# EAGLE design Camera Gantry (EAGLE 6.4)
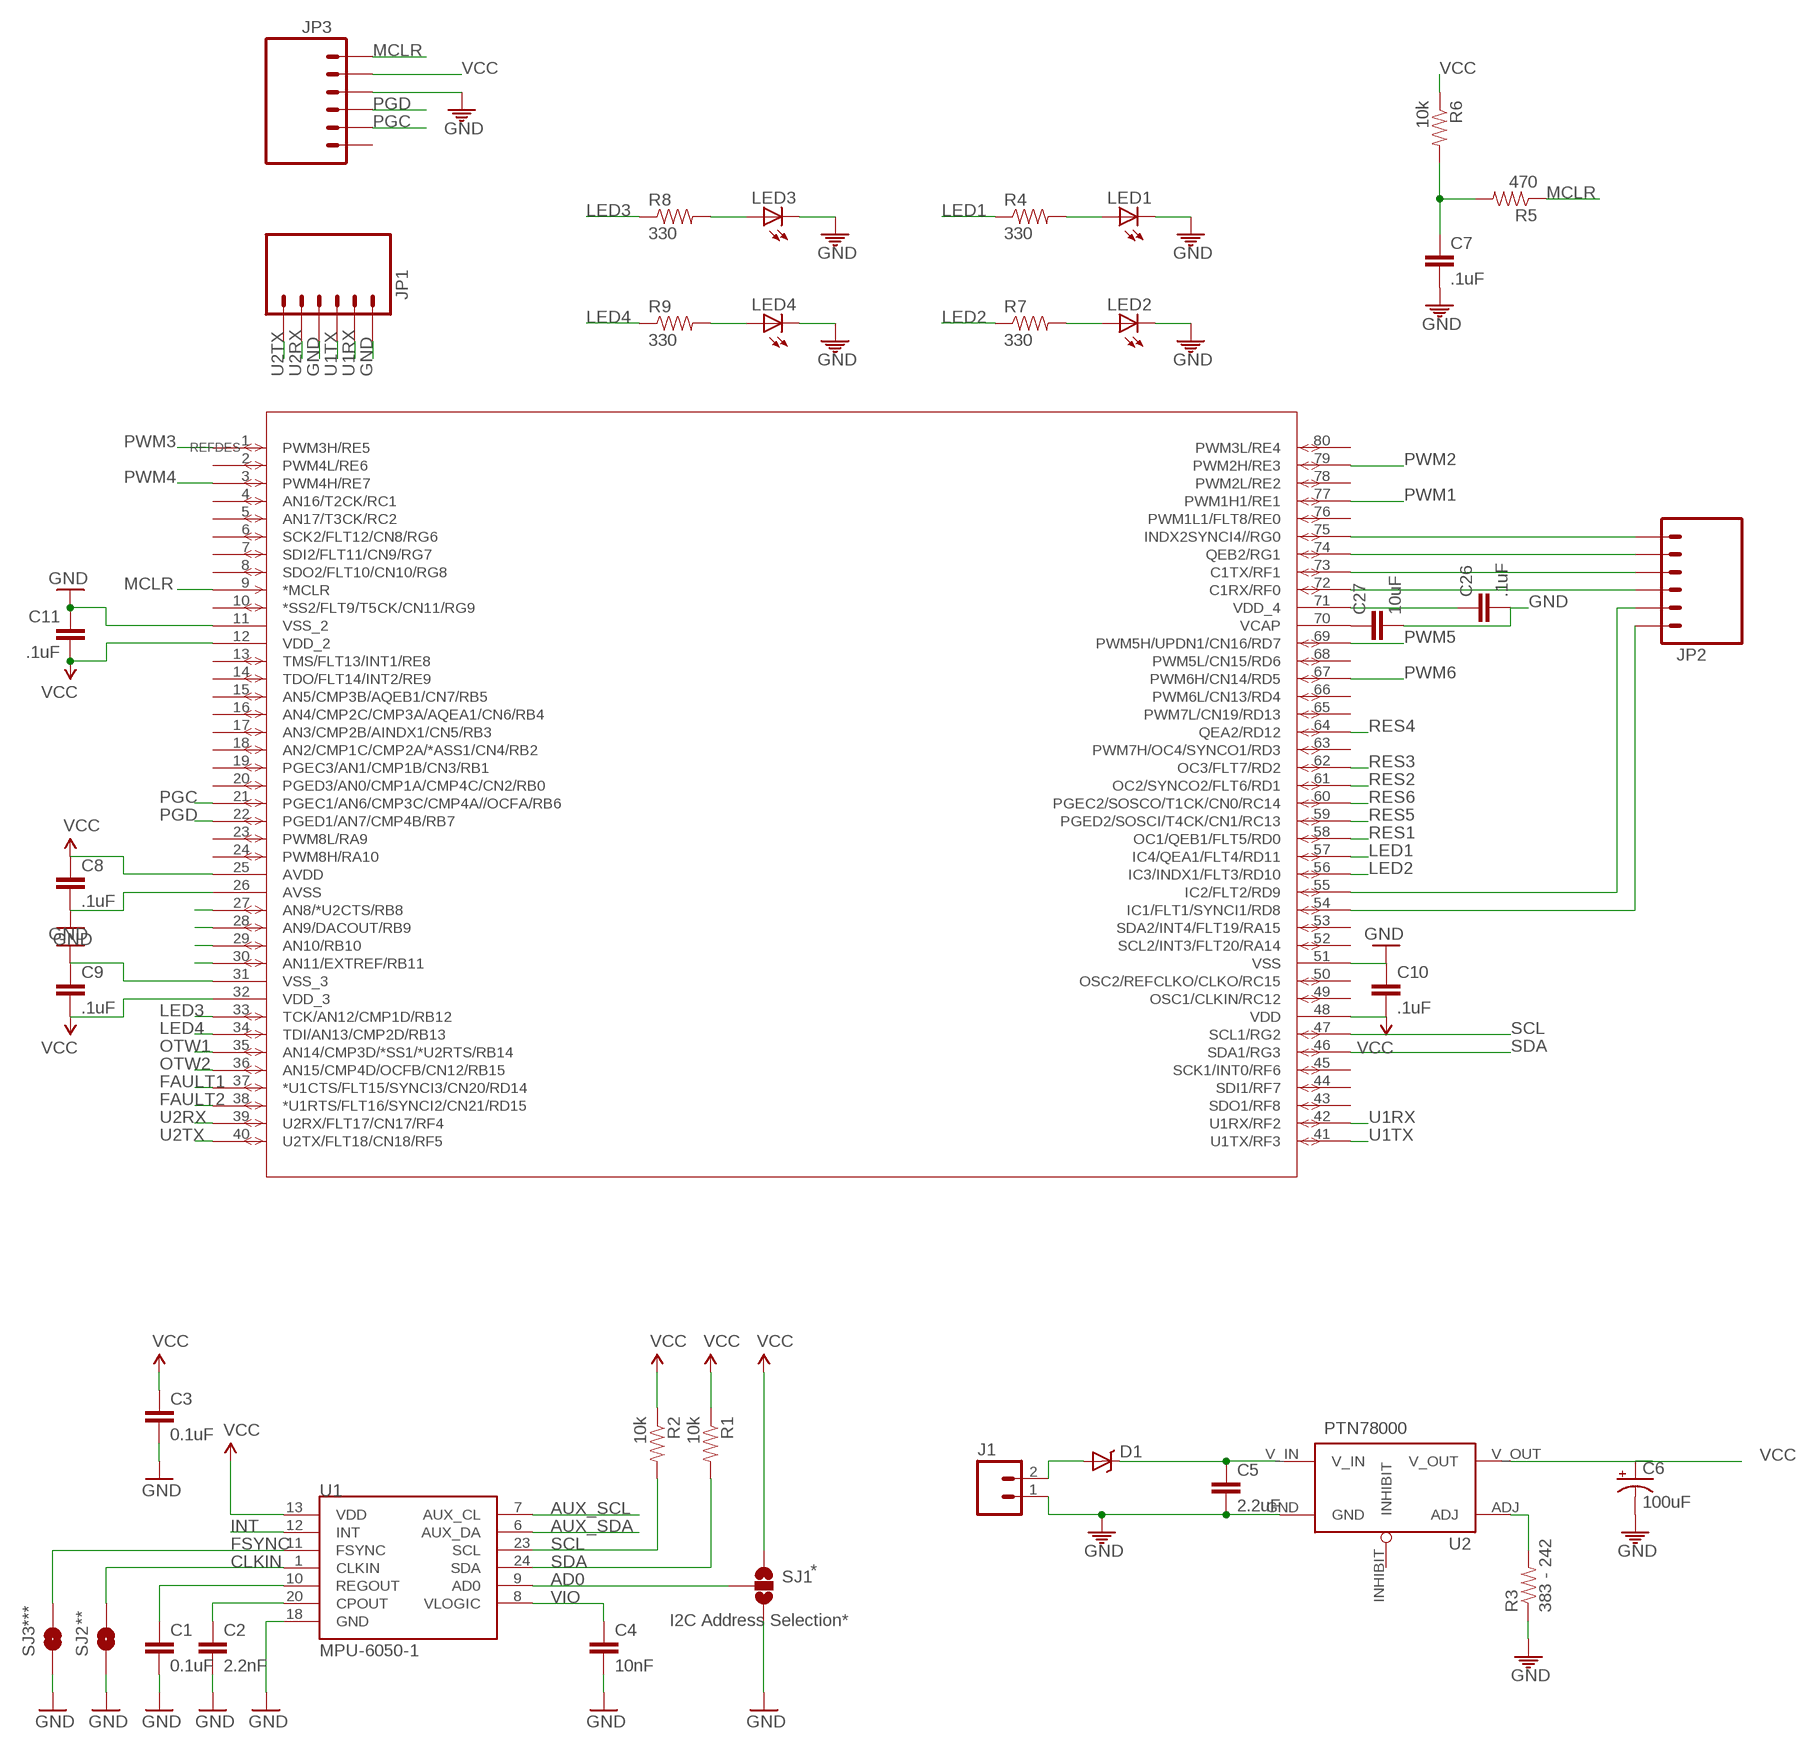
[diagram p0: schematic, sheet 1, part 1 of 2]
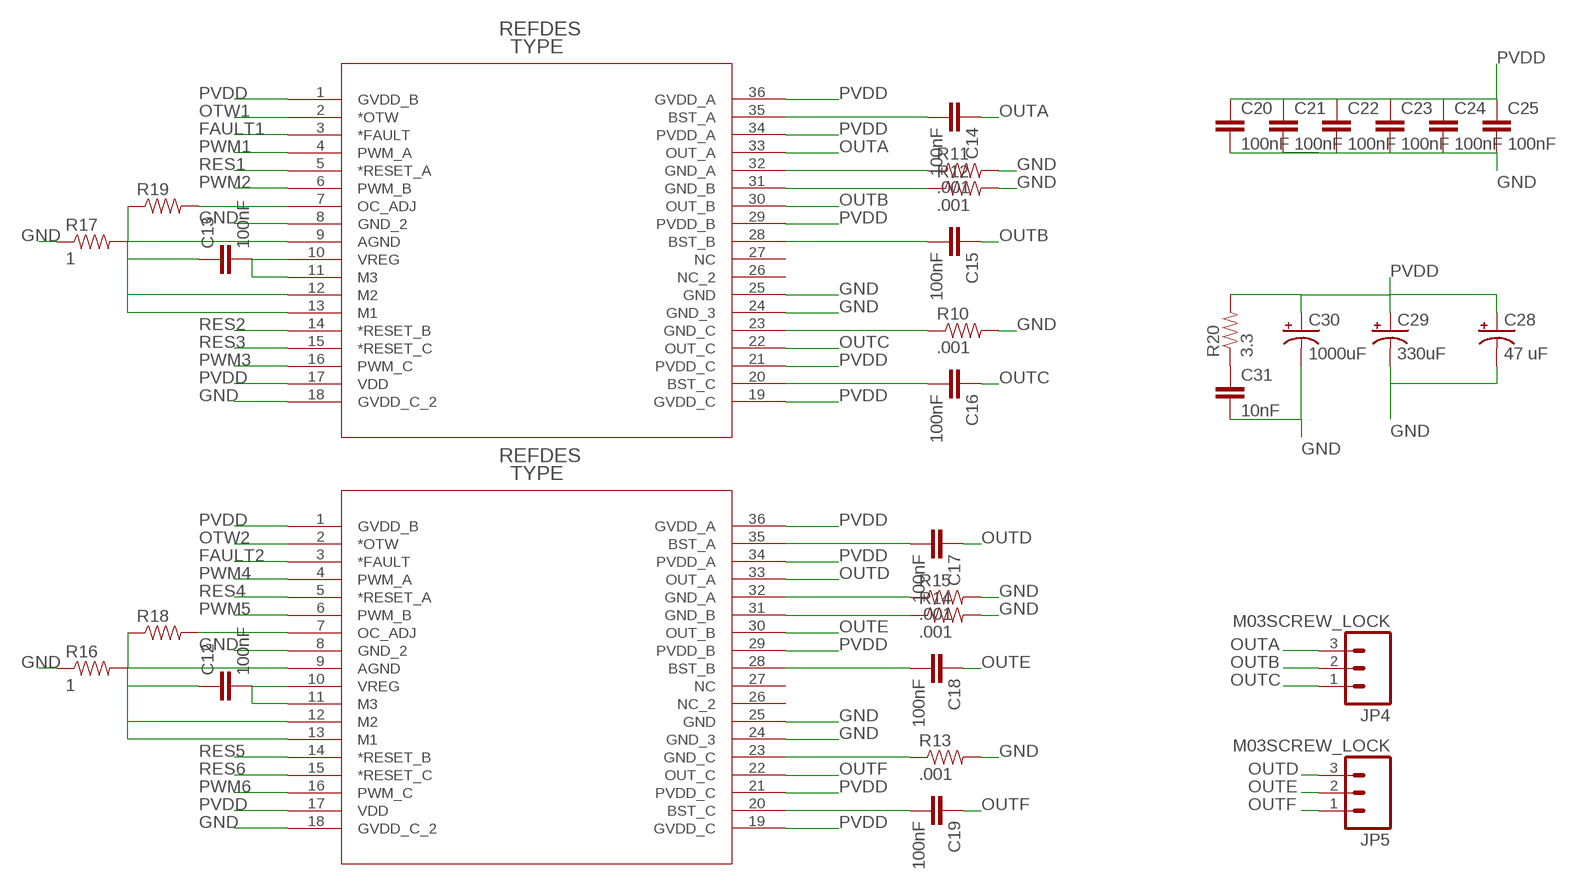
[diagram p1: schematic, sheet 1, part 2 of 2]

## Parts
C1  0.1uF  CAP1206  [1206]
C2  2.2nF  CAP1206  [1206]
C3  0.1uF  CAP1206  [1206]
C4  10nF  CAP1206  [1206]
C5  2.2uF  CAP1206  [1206]
C6  100uF  CAP_POLPTH1  [CPOL-RADIAL-100UF-25V]
C7  .1uF  CAP1206  [1206]
C8  .1uF  CAP1206  [1206]
C9  .1uF  CAP1206  [1206]
C10  .1uF  CAP1206  [1206]
C11  .1uF  CAP1206  [1206]
C12  100nF  CAP1206  [1206]
C13  100nF  CAP1206  [1206]
C14  100nF  CAP1206  [1206]
C15  100nF  CAP1206  [1206]
C16  100nF  CAP1206  [1206]
C17  100nF  CAP1206  [1206]
C18  100nF  CAP1206  [1206]
C19  100nF  CAP1206  [1206]
C20  100nF  CAP1206  [1206]
C21  100nF  CAP1206  [1206]
C22  100nF  CAP1206  [1206]
C23  100nF  CAP1206  [1206]
C24  100nF  CAP1206  [1206]
C25  100nF  CAP1206  [1206]
C26  .1uF  CAP1206  [1206]
C27  10uF  CAP1206  [1206]
C28  47 uF  CAP_POLPTH2  [CPOL-RADIAL-10UF-25V]
C29  330uF  CAP_POLPTH1  [CPOL-RADIAL-100UF-25V]
C30  1000uF  CAP_POLPTH4  [CPOL-RADIAL-1000UF-25V]
C31  10nF  CAP1206  [1206]
D1  DIODE-SCHOTTKY240A  [SMA-DIODE-B240A]
J1  M025MM  [SCREWTERMINAL-5MM-2]
JP1  M06SIP  [1X06]
JP2  M06SIP  [1X06]
JP3  M06LOCK  [1X06_LOCK]
JP4  M03SCREW_LOCK  [SCREWTERMINAL-3.5MM-3_LOCK.007S]
JP5  M03SCREW_LOCK  [SCREWTERMINAL-3.5MM-3_LOCK.007S]
LED1  LED1206  [LED-1206]
LED2  LED1206  [LED-1206]
LED3  LED1206  [LED-1206]
LED4  LED1206  [LED-1206]
R1  10k  RESISTOR0805-RES  [0805]
R2  10k  RESISTOR0805-RES  [0805]
R3  383 - 242  RESISTOR0805-RES  [0805]
R4  330  RESISTOR0805-RES  [0805]
R5  470  RESISTOR0805-RES  [0805]
R6  10k  RESISTOR0805-RES  [0805]
R7  330  RESISTOR0805-RES  [0805]
R8  330  RESISTOR0805-RES  [0805]
R9  330  RESISTOR0805-RES  [0805]
R10  .001  RESISTOR2512  [R2512]
R11  .001  RESISTOR2512  [R2512]
R12  .001  RESISTOR2512  [R2512]
R13  .001  RESISTOR2512  [R2512]
R14  .001  RESISTOR2512  [R2512]
R15  .001  RESISTOR2512  [R2512]
R16  1  RESISTOR0805-RES  [0805]
R17  1  RESISTOR0805-RES  [0805]
R18  RESISTOR0805-RES  [0805]
R19  RESISTOR0805-RES  [0805]
R20  3.3  RESISTOR0805-RES  [0805]
SJ1  SOLDERJUMPER_2WAYPASTE2&3  [SJ_3_PASTE2&3]
SJ2  SOLDERJUMPERTRACE  [SJ_2S-TRACE]
SJ3  SOLDERJUMPERTRACE  [SJ_2S-TRACE]
U1  MPU-6050-1  [QFN-24-4MM2]
U2  PTN78000  PTN78000THROUGH-HOLE  [PTN78000]
U3  DRV8332_DKD_36  [DKD36]
U4  DRV8332_DKD_36  [DKD36]
U$1  DSPIC33FJ64GS608  [TQFP80_12X12MC]

## Nets
AD0: SJ1.2 U1.9(AD0)
AUX_SCL: U1.7(AUX_CL)
AUX_SDA: U1.6(AUX_DA)
CLKIN: SJ2.2 U1.1(CLKIN)
FAULT1: U3.3(*FAULT) U$1.37(*U1CTS/FLT15/SYNCI3/CN20/RD14)
FAULT2: U4.3(*FAULT) U$1.38(*U1RTS/FLT16/SYNCI2/CN21/RD15)
FSYNC: SJ3.2 U1.11(FSYNC)
GND: C1.2 C2.2 C3.2 C4.2 C5.2 C6.2(-) C7.2 C8.2 C9.1 C10.1 C11.1 C20.2 C21.2 C22.2 C23.2 C24.2 C25.2 C26.2 C27.2 C28.2(-) C29.2(-) C30.2(-) C31.2 J1.1 JP1.1 JP1.4 JP3.3 LED1.C LED2.C LED3.C LED4.C R3.1 R10.2 R11.2 R12.2 R13.2 R14.2 R15.2 R16.1 R17.1 SJ1.3 SJ2.1 SJ3.1 U1.18(GND) U2.GND U3.8(GND_2) U3.18(GVDD_C_2) U3.24(GND_3) U3.25(GND) U4.8(GND_2) U4.18(GVDD_C_2) U4.24(GND_3) U4.25(GND) U$1.11(VSS_2) U$1.26(AVSS) U$1.31(VSS_3) U$1.51(VSS)
INT: U1.12(INT)
LED1: R4.1 U$1.57(IC4/QEA1/FLT4/RD11)
LED2: R7.1 U$1.56(IC3/INDX1/FLT3/RD10)
LED3: R8.1 U$1.33(TCK/AN12/CMP1D/RB12)
LED4: R9.1 U$1.34(TDI/AN13/CMP2D/RB13)
MCLR: JP3.1 R5.1 U$1.9(*MCLR)
N$1: LED1.A R4.2
N$2: C7.1 R5.2 R6.2
N$3: C2.1 U1.20(CPOUT)
N$4: LED2.A R7.2
N$5: C1.1 U1.10(REGOUT)
N$6 [power]: R3.2 U2.ADJ
N$7: D1.A J1.2
N$8: LED3.A R8.2
N$9: LED4.A R9.2
N$10: U$1.27(AN8/*U2CTS/RB8)
N$11: U$1.28(AN9/DACOUT/RB9)
N$12: U$1.29(AN10/RB10)
N$13: U$1.30(AN11/EXTREF/RB11)
N$14: R11.1 U3.32(GND_A)
N$15: R12.1 U3.31(GND_B)
N$16: R10.1 U3.23(GND_C)
N$17: C13.1 R17.2 R19.1 U3.9(AGND) U3.12(M2) U3.13(M1)
N$18: C12.1 R16.2 R18.1 U4.9(AGND) U4.12(M2) U4.13(M1)
N$19: R18.2 U4.7(OC_ADJ)
N$20: C12.2 U4.10(VREG) U4.11(M3)
N$21: C13.2 U3.10(VREG) U3.11(M3)
N$22: R15.1 U4.32(GND_A)
N$23: R14.1 U4.31(GND_B)
N$24: R13.1 U4.23(GND_C)
N$25: C17.2 U4.35(BST_A)
N$26: C18.2 U4.28(BST_B)
N$27: C19.2 U4.20(BST_C)
N$28: C14.2 U3.35(BST_A)
N$29: C15.2 U3.28(BST_B)
N$30: C16.2 U3.20(BST_C)
N$31: JP2.3 U$1.72(C1RX/RF0)
N$32: JP2.4 U$1.73(C1TX/RF1)
N$33: JP2.5 U$1.74(QEB2/RG1)
N$34: R19.2 U3.7(OC_ADJ)
N$35: JP2.6 U$1.75(INDX2SYNCI4//RG0)
N$36: JP2.1 U$1.54(IC1/FLT1/SYNCI1/RD8)
N$37: JP2.2 U$1.55(IC2/FLT2/RD9)
N$38: C26.1 U$1.71(VDD_4)
N$39: C27.1 U$1.70(VCAP)
N$41: C31.1 R20.1
OTW1: U3.2(*OTW) U$1.35(AN14/CMP3D/*SS1/*U2RTS/RB14)
OTW2: U4.2(*OTW) U$1.36(AN15/CMP4D/OCFB/CN12/RB15)
OUTA: C14.1 JP4.3 U3.33(OUT_A)
OUTB: C15.1 JP4.2 U3.30(OUT_B)
OUTC: C16.1 JP4.1 U3.22(OUT_C)
OUTD: C17.1 JP5.3 U4.33(OUT_A)
OUTE: C18.1 JP5.2 U4.30(OUT_B)
OUTF: C19.1 JP5.1 U4.22(OUT_C)
PGC: JP3.5 U$1.21(PGEC1/AN6/CMP3C/CMP4A//OCFA/RB6)
PGD [small]: JP3.4 U$1.22(PGED1/AN7/CMP4B/RB7)
PVDD [power]: C5.1 C20.1 C21.1 C22.1 C23.1 C24.1 C25.1 C28.1(+) C29.1(+) C30.1(+) D1.C R20.2 U2.V_IN U3.1(GVDD_B) U3.17(VDD) U3.19(GVDD_C) U3.21(PVDD_C) U3.29(PVDD_B) U3.34(PVDD_A) U3.36(GVDD_A) U4.1(GVDD_B) U4.17(VDD) U4.19(GVDD_C) U4.21(PVDD_C) U4.29(PVDD_B) U4.34(PVDD_A) U4.36(GVDD_A)
PWM1: U3.4(PWM_A) U$1.77(PWM1H1/RE1)
PWM2: U3.6(PWM_B) U$1.79(PWM2H/RE3)
PWM3: U3.16(PWM_C) U$1.1(PWM3H/RE5)
PWM4: U4.4(PWM_A) U$1.3(PWM4H/RE7)
PWM5: U4.6(PWM_B) U$1.69(PWM5H/UPDN1/CN16/RD7)
PWM6: U4.16(PWM_C) U$1.67(PWM6H/CN14/RD5)
RES1: U3.5(*RESET_A) U$1.58(OC1/QEB1/FLT5/RD0)
RES2: U3.14(*RESET_B) U$1.61(OC2/SYNCO2/FLT6/RD1)
RES3: U3.15(*RESET_C) U$1.62(OC3/FLT7/RD2)
RES4: U4.5(*RESET_A) U$1.64(QEA2/RD12)
RES5: U4.14(*RESET_B) U$1.59(PGED2/SOSCI/T4CK/CN1/RC13)
RES6: U4.15(*RESET_C) U$1.60(PGEC2/SOSCO/T1CK/CN0/RC14)
SCL: R2.2 U1.23(SCL) U$1.47(SCL1/RG2)
SDA: R1.2 U1.24(SDA) U$1.46(SDA1/RG3)
U1RX: JP1.2 U$1.42(U1RX/RF2)
U1TX: JP1.3 U$1.41(U1TX/RF3)
U2RX: JP1.5 U$1.39(U2RX/FLT17/CN17/RF4)
U2TX: JP1.6 U$1.40(U2TX/FLT18/CN18/RF5)
VCC: C3.1 C6.1(+) C8.1 C9.2 C10.2 C11.2 JP3.2 R1.1 R2.1 R6.1 SJ1.1 U1.13(VDD) U2.V_OUT U$1.12(VDD_2) U$1.25(AVDD) U$1.32(VDD_3) U$1.48(VDD)
VIO: C4.1 U1.8(VLOGIC)
Unconnected: JP3.6 U2.INHIBIT U3.26(NC_2) U3.27(NC) U4.26(NC_2) U4.27(NC) U$1.2(PWM4L/RE6) U$1.4(AN16/T2CK/RC1) U$1.5(AN17/T3CK/RC2) U$1.6(SCK2/FLT12/CN8/RG6) U$1.7(SDI2/FLT11/CN9/RG7) U$1.8(SDO2/FLT10/CN10/RG8) U$1.10(*SS2/FLT9/T5CK/CN11/RG9) U$1.13(TMS/FLT13/INT1/RE8) U$1.14(TDO/FLT14/INT2/RE9) U$1.15(AN5/CMP3B/AQEB1/CN7/RB5) U$1.16(AN4/CMP2C/CMP3A/AQEA1/CN6/RB4) U$1.17(AN3/CMP2B/AINDX1/CN5/RB3) U$1.18(AN2/CMP1C/CMP2A/*ASS1/CN4/RB2) U$1.19(PGEC3/AN1/CMP1B/CN3/RB1) U$1.20(PGED3/AN0/CMP1A/CMP4C/CN2/RB0) U$1.23(PWM8L/RA9) U$1.24(PWM8H/RA10) U$1.43(SDO1/RF8) U$1.44(SDI1/RF7) U$1.45(SCK1/INT0/RF6) U$1.49(OSC1/CLKIN/RC12) U$1.50(OSC2/REFCLKO/CLKO/RC15) U$1.52(SCL2/INT3/FLT20/RA14) U$1.53(SDA2/INT4/FLT19/RA15) U$1.63(PWM7H/OC4/SYNCO1/RD3) U$1.65(PWM7L/CN19/RD13) U$1.66(PWM6L/CN13/RD4) U$1.68(PWM5L/CN15/RD6) U$1.76(PWM1L1/FLT8/RE0) U$1.78(PWM2L/RE2) U$1.80(PWM3L/RE4)

## Notes on the sheet
- *
- *** | ** | I2C Address Selection*

## Library data of the parts
C1-C4 C8-C27 C31 = ASL:CAP: Capacitor Standard 0603 ceramic capacitor, and 0.1" leaded capacitor.
C5 C7 = CMPE118lib:CAP: Capacitor Standard 0603 ceramic capacitor, and 0.1" leaded capacitor.
C6 C28-C30 = ASL:CAP_POL: Capacitor Polarized These are standard SMD and PTH capacitors. Normally 10uF, 47uF, and 100uF in electrolytic and tantalum varieties. Always verify the external diameter of the through hole cap, it varies with capacity, voltage, and manufacturer. The EIA devices should be standard.
D1 = CMPE118lib:DIODE-SCHOTTKY
J1 = ASL:M02: Header 2 Standard 2-pin 0.1" header. Use with straight break away headers (SKU : PRT-00116), right angle break away headers (PRT-00553), swiss pins (PRT-00743), machine pins (PRT-00117), and female headers (PRT-00115). Molex polarized connector foot print use with SKU : PRT-08233 with associated crimp pins and housings.
JP1 JP2 = ASL:M06: Header 6 Standard 6-pin 0.1" header. Use with straight break away headers (SKU : PRT-00116), right angle break away headers (PRT-00553), swiss pins (PRT-00743), machine pins (PRT-00117), and female headers (PRT-00115). Molex polarized connector foot print use with SKU : PRT-08094 with associated crimp pins and housings. NOTES ON THE VARIANTS LOCK and LOCK_LONGPADS... This footprint was designed to help hold the alignment of a through-hole component (i.e. 6-pin header) while soldering it into place. You may notice that each hole has been shifted either up or down by 0.005 of an inch from it's more standard position (which is a perfectly straight line). This slight alteration caused the pins (the squares in the middle) to touch the edges of the holes. Because they are alternating, it causes a "brace" to hold the component in place. 0.005 has proven to be the perfect amount of "off-center" position when using our standard breakaway headers. Although looks a little odd when you look at the bare footprint, once you have a header in there, the alteration is very hard to notice. Also, if you push a header all the way into place, it is covered up entirely on the bottom side. This idea of altering the position of holes to aid alignment will be further integrated into the Sparkfun Library for other footprints. It can help hold any component with 3 or more connection pins.
JP3 = CMPE118lib:M06: Header 6 Standard 6-pin 0.1" header. Use with straight break away headers (SKU : PRT-00116), right angle break away headers (PRT-00553), swiss pins (PRT-00743), machine pins (PRT-00117), and female headers (PRT-00115). Molex polarized connector foot print use with SKU : PRT-08094 with associated crimp pins and housings. NOTES ON THE VARIANTS LOCK and LOCK_LONGPADS... This footprint was designed to help hold the alignment of a through-hole component (i.e. 6-pin header) while soldering it into place. You may notice that each hole has been shifted either up or down by 0.005 of an inch from it's more standard position (which is a perfectly straight line). This slight alteration caused the pins (the squares in the middle) to touch the edges of the holes. Because they are alternating, it causes a "brace" to hold the component in place. 0.005 has proven to be the perfect amount of "off-center" position when using our standard breakaway headers. Although looks a little odd when you look at the bare footprint, once you have a header in there, the alteration is very hard to notice. Also, if you push a header all the way into place, it is covered up entirely on the bottom side. This idea of altering the position of holes to aid alignment will be further integrated into the Sparkfun Library for other footprints. It can help hold any component with 3 or more connection pins.
JP4 JP5 = ASL:M03: Header 3 Standard 3-pin 0.1" header. Use with straight break away headers (SKU : PRT-00116), right angle break away headers (PRT-00553), swiss pins (PRT-00743), machine pins (PRT-00117), and female headers (PRT-00115). Molex polarized connector foot print use with SKU : PRT-08232 with associated crimp pins and housings.
LED1-LED4 = CMPE118lib:LED: LEDs Standard schematic elements and footprints for 5mm, 3mm, 1206, and 0603 sized LEDs. 5mm - Spark Fun Electronics SKU : COM-00529 (and others); COLOR: red
R1-R9 = CMPE118lib:RESISTOR: Resistor Basic schematic elements and footprints for 0603, 1206, and PTH resistors.
R10-R20 = ASL:RESISTOR: Resistor Basic schematic elements and footprints for 0603, 1206, and PTH resistors.
SJ1 = SparkFun:SOLDERJUMPER_2WAY: Solder Jumper 2 way solder jumper
SJ2 SJ3 = SparkFun:SOLDERJUMPER: Solder Jumper Standard SMD solder jumper. Used to automate production. Two varients : Normally Open and Normally Closed are the same, but have different paste layers. NC will have a large amount of paste and should jumper during reflow.
U1 = Testing:MPU-6050
U2 = ASL:PTN78000: This is the PTN78000 part by Texas Instruments. It's a 1.5A adjustable switching regulator.
U3 U4 = CameraGantry:DRV8332_DKD_36
U$1 = CameraGantry:DSPIC33FJ64GS608

## Net classes
0 default: width 0.406 mm
1 power: width 0.762 mm, clearance 0.254 mm to class 0, clearance 0.508 mm
2 small: width 0.254 mm, clearance 0.254 mm to class 1

## Board
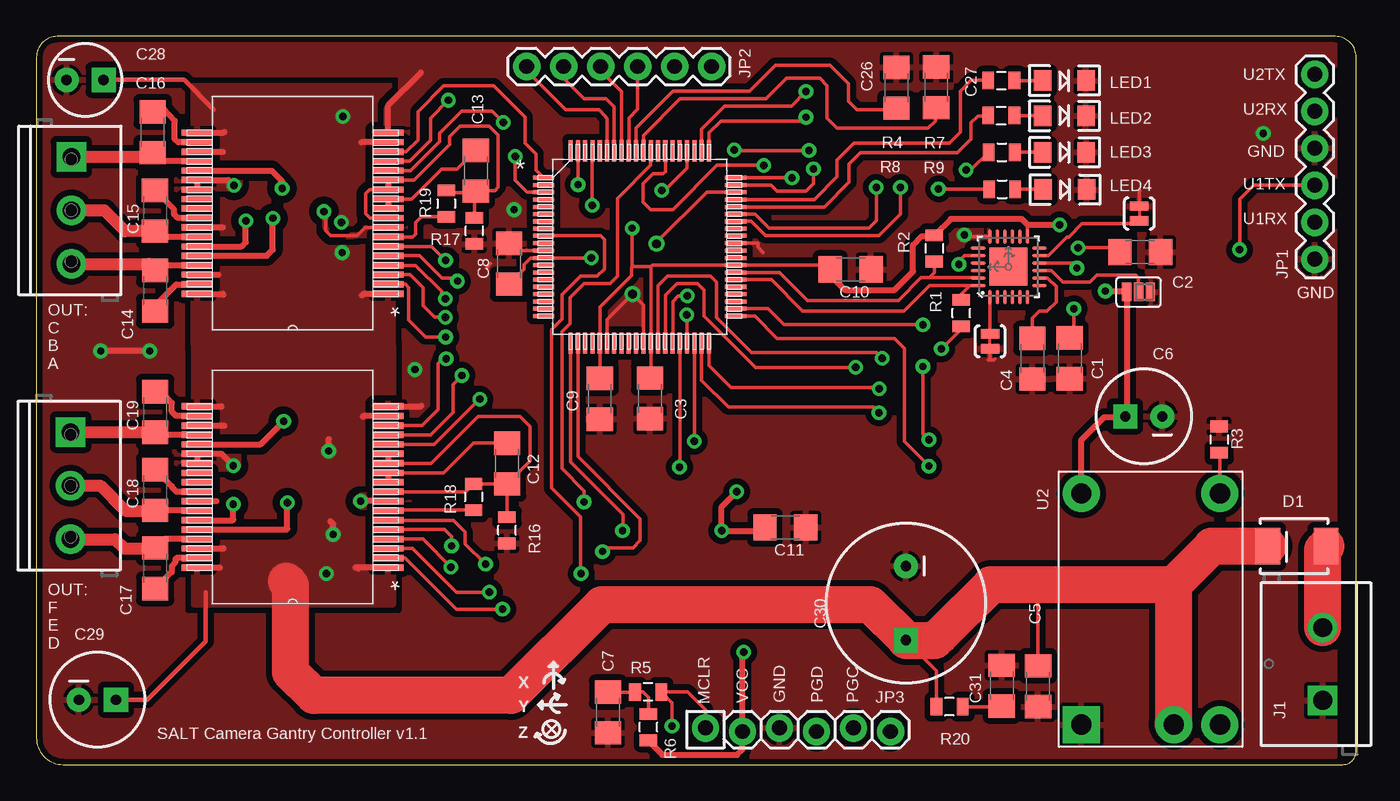
[diagram p2: board, top side]
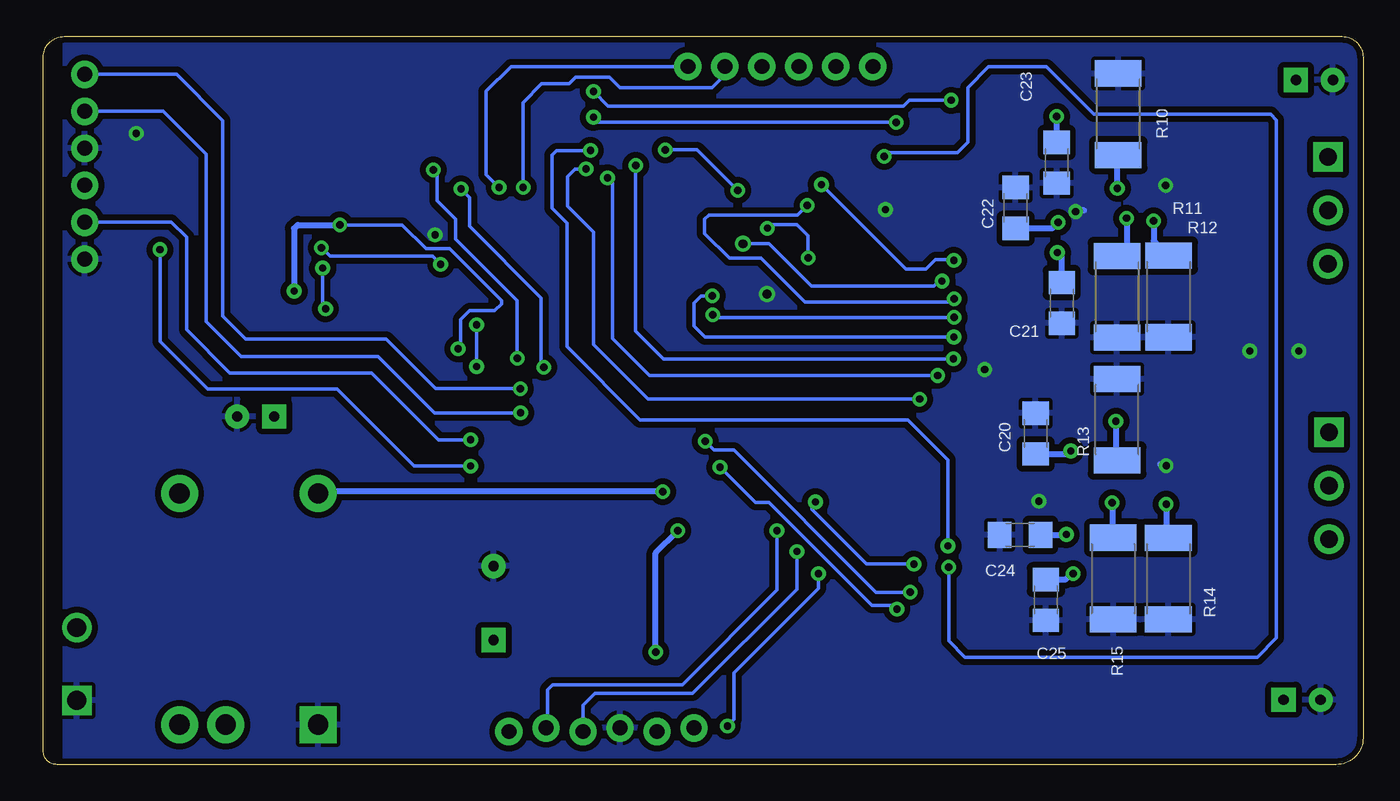
[diagram p3: board, bottom side, seen from below]

Size 90.6 x 50 mm. Coordinates in mm from the lower left corner, seen from the top.
Outline: 0,48.58 0,1.83 arc90 1.83,0 89.67,0 arc90 90.6,0.93 90.6,48.58 arc90 89.18,50 1.42,50 arc90 0,48.58
Copper layers (1*16): Top 0.035mm / dielectric 1.5mm / Bottom 0.035mm
Design rules "SparkFun": minimum track width 8mil, minimum drill 20mil, track to track 8mil, track to pad 8mil, pad to pad 8mil, via to via 8mil, smd to smd 8mil, copper to edge 10mil, drill to drill 8mil, minimum pad ring 12mil, minimum via ring 10mil, stop-mask expansion 4mil, vias tented up to drill 25mil, thermal gap 10mil

### Footprints (pad centres in the part's own frame; a part is rotated, then mirrored left to right if it is on the bottom)
1206 = smd 1.6 x 1.8: 1 -1.4,0; 2 1.4,0
CPOL-RADIAL-100UF-25V = drill 0.7 pad 1.651 square: 1 1.27,0 | drill 0.7 pad 1.651: 2 -1.27,0
CPOL-RADIAL-10UF-25V = drill 0.7 pad 1.651 square: 1 1.27,0 | drill 0.7 pad 1.651: 2 -1.27,0
CPOL-RADIAL-1000UF-25V = drill 0.7 pad 1.651 square: 1 2.54,0 | drill 0.7 pad 1.651: 2 -2.54,0
SMA-DIODE-B240A = smd 1.7 x 2.5: A 0,0; C 4,0
SCREWTERMINAL-5MM-2 = drill 1.3 pad 2.032 square: 1 0,0 | drill 1.3 pad 2.032: 2 5,0
1X06 = drill 1.016 pad 1.88: 1 -6.35,0; 2 -3.81,0; 3 -1.27,0; 4 1.27,0; 5 3.81,0; 6 6.35,0
1X06_LOCK = drill 1.016 pad 1.88: 1 0,0.127; 2 2.54,-0.127; 3 5.08,0.127; 4 7.62,-0.127; 5 10.16,0.127; 6 12.7,-0.127
SCREWTERMINAL-3.5MM-3_LOCK.007S = drill 1.2 pad 2.032 square: 1 -0.178,0 | drill 1.2 pad 2.032: 2 3.5,0; 3 7.178,0
LED-1206 = smd 1.2 x 1.4: A -1.5,0; C 1.5,0
0805 = smd 0.8 x 1.2: 1 -0.9,0; 2 0.9,0
R2512 = smd 1.8 x 3.2: 1 -2.8,0; 2 2.8,0
SJ_3_PASTE2&3 = smd 0.635 x 1.27: 1 -0.813,0; 2 0,0; 3 0.813,0
SJ_2S-TRACE = smd 0.635 x 1.27: 1 -0.508,0; 2 0.508,0
QFN-24-4MM2 = smd 1.016 x 0.254: 1 -2.066,1.257; 2 -2.066,0.75; 3 -2.066,0.247; 4 -2.066,-0.287; 5 -2.066,-0.792; 6 -2.066,-1.297; 13 2.086,-1.297; 14 2.086,-0.792; 15 2.086,-0.287; 16 2.086,0.247; 17 2.086,0.75; 18 2.086,1.257 | smd 0.254 x 1.016: 7 -1.267,-2.122; 8 -0.762,-2.122; 9 -0.258,-2.122; 10 0.278,-2.122; 11 0.78,-2.122; 12 1.287,-2.122; 19 1.287,2.082; 20 0.78,2.082; 21 0.278,2.082; 22 -0.258,2.082; 23 -0.762,2.082; 24 -1.267,2.082 | smd 2.616 x 2.616: P$1 0.02,-0.01
PTN78000 = drill 1.397 pad 2.54: ADJ 15.875,-9.525; INHIBIT 0,-9.525; V_IN 0,-6.35; V_OUT 15.875,0 | drill 1.397 pad 2.54 square: GND 0,0
DKD36 = smd 2.108 x 0.432: 1 -6.553,5.537; 2 -6.553,4.877; 3 -6.553,4.216; 4 -6.553,3.581; 5 -6.553,2.921; 6 -6.553,2.286; 7 -6.553,1.626; 8 -6.553,0.965; 9 -6.553,0.33; 10 -6.553,-0.33; 11 -6.553,-0.965; 12 -6.553,-1.626; 13 -6.553,-2.286; 14 -6.553,-2.921; 15 -6.553,-3.581; 16 -6.553,-4.216; 17 -6.553,-4.877; 18 -6.553,-5.537; 19 6.553,-5.537; 20 6.553,-4.877; 21 6.553,-4.216; 22 6.553,-3.581; 23 6.553,-2.921; 24 6.553,-2.286; 25 6.553,-1.626; 26 6.553,-0.965; 27 6.553,-0.33; 28 6.553,0.33; 29 6.553,0.965; 30 6.553,1.626; 31 6.553,2.286; 32 6.553,2.921; 33 6.553,3.581; 34 6.553,4.216; 35 6.553,4.877; 36 6.553,5.537
TQFP80_12X12MC = smd 1.473 x 0.279: 1 -6.604,4.75; 2 -6.604,4.242; 3 -6.604,3.759; 4 -6.604,3.251; 5 -6.604,2.743; 6 -6.604,2.261; 7 -6.604,1.753; 8 -6.604,1.245; 9 -6.604,0.762; 10 -6.604,0.254; 11 -6.604,-0.254; 12 -6.604,-0.762; 13 -6.604,-1.245; 14 -6.604,-1.753; 15 -6.604,-2.261; 16 -6.604,-2.743; 17 -6.604,-3.251; 18 -6.604,-3.759; 19 -6.604,-4.242; 20 -6.604,-4.75; 41 6.604,-4.75; 42 6.604,-4.242; 43 6.604,-3.759; 44 6.604,-3.251; 45 6.604,-2.743; 46 6.604,-2.261; 47 6.604,-1.753; 48 6.604,-1.245; 49 6.604,-0.762; 50 6.604,-0.254; 51 6.604,0.254; 52 6.604,0.762; 53 6.604,1.245; 54 6.604,1.753; 55 6.604,2.261; 56 6.604,2.743; 57 6.604,3.251; 58 6.604,3.759; 59 6.604,4.242; 60 6.604,4.75 | smd 0.279 x 1.473: 21 -4.75,-6.604; 22 -4.242,-6.604; 23 -3.759,-6.604; 24 -3.251,-6.604; 25 -2.743,-6.604; 26 -2.261,-6.604; 27 -1.753,-6.604; 28 -1.245,-6.604; 29 -0.762,-6.604; 30 -0.254,-6.604; 31 0.254,-6.604; 32 0.762,-6.604; 33 1.245,-6.604; 34 1.753,-6.604; 35 2.261,-6.604; 36 2.743,-6.604; 37 3.251,-6.604; 38 3.759,-6.604; 39 4.242,-6.604; 40 4.75,-6.604; 61 4.75,6.604; 62 4.242,6.604; 63 3.759,6.604; 64 3.251,6.604; 65 2.743,6.604; 66 2.261,6.604; 67 1.753,6.604; 68 1.245,6.604; 69 0.762,6.604; 70 0.254,6.604; 71 -0.254,6.604; 72 -0.762,6.604; 73 -1.245,6.604; 74 -1.753,6.604; 75 -2.261,6.604; 76 -2.743,6.604; 77 -3.251,6.604; 78 -3.759,6.604; 79 -4.242,6.604; 80 -4.75,6.604

### Placement (x,y rotation side)
C1  70.93,27.89 270 top
C2  75.77,35.18 0 top
C3  42.13,25.15 270 top
C4  68.37,27.88 270 top
C5  68.76,5.38 270 top
C6  76.02,23.91 180 top
C7  39.24,3.58 270 top
C8  32.44,34.39 90 top
C9  38.68,25.12 90 top
C10  55.9,34 180 top
C11  51.41,16.29 180 top
C12  32.31,20.67 90 top
C13  30.17,40.78 90 top
C14  8.16,32.54 270 top
C15  8.14,38.03 90 top
C16  7.99,43.42 90 top
C17  8.16,13.48 270 top
C18  8.16,18.85 90 top
C19  8.16,24.21 90 top
C20  22.48,22.73 90 bottom
C21  20.69,31.7 270 bottom
C22  23.86,38.22 90 bottom
C23  21.04,41.32 270 bottom
C24  23.55,15.77 180 bottom
C25  21.78,11.3 270 bottom
C26  59.04,46.47 90 top
C27  61.77,46.5 90 top
C28  3.34,47.01 0 top
C29  4.19,4.46 0 top
C30  59.68,11.09 270 top
C31  66.27,5.42 90 top
D1  88.53,14.99 180 top
J1  88.3,4.4 90 top
JP1  87.76,41.05 90 top
JP2  40,47.93 180 top
JP3  45.93,2.39 0 top
JP4  2.4,41.55 270 top
JP5  2.35,22.65 270 top
LED1  70.56,46.97 0 top
LED2  70.56,44.54 0 top
LED3  70.57,42.04 0 top
LED4  70.6,39.48 0 top
R1  63.49,31.01 90 top
R2  61.64,35.44 270 top
R3  81.2,22.32 270 top
R4  66.24,46.97 0 top
R5  41.99,4.98 180 top
R6  42.01,2.57 90 top
R7  66.23,44.56 0 top
R8  66.27,42.05 0 top
R9  66.29,39.5 0 top
R10  16.81,44.65 90 bottom
R11  16.89,32.12 270 bottom
R12  13.36,32.14 270 bottom
R13  16.89,23.68 90 bottom
R14  13.37,12.76 270 bottom
R15  17.15,12.78 270 bottom
R16  32.31,16.09 90 top
R17  30.06,36.65 90 top
R18  30.01,18.37 270 top
R19  28.14,38.52 270 top
R20  62.68,3.98 180 top
SJ1  75.66,32.45 0 top
SJ2  65.47,29.07 90 top
SJ3  75.7,37.84 270 top
U1  66.73,34.17 90 top
U2  71.73,2.74 90 top
U3  17.59,37.86 180 top
U4  17.59,19.06 180 top
U$1  41.42,35.55 0 top

### Tracks (layer width: path | path; a pad name or v marks a point on that pad's centre or on a via)
AD0
  Top 0.254: SJ1.2 75.64,32.46 75.64,33.43 75.46,33.6 72.8,33.6 72.31,33.12 70.46,33.12 69.67,33.91 U1.9
CLKIN
  Top 0.254: U1.1 SJ2.2
FAULT1  (via drill 0.5)
  Top 0.254: U3.3 25.64,33.64 26.54,32.74 26.54,31.52 27.33,30.73 28.04,30.73 v28.07,30.71 | v44.65,30.89 44.65,28.96 U$1.37
  Bottom 0.254: 44.45,30.68 v44.65,30.89 44.48,30.71 v28.07,30.71
FAULT2  (via drill 0.5)
  Top 0.254: U4.3 25.82,14.84 28.83,11.84 v31.09,11.84 | v45.16,22.2 45.16,28.93 U$1.38
  Bottom 0.254: v45.16,22.2 44.55,21.59 43.18,21.59 33.43,11.84 v31.09,11.84
FSYNC
  Top 0.254: U1.11 69.47,34.95 70.74,36.22 70.87,36.22 71.78,37.13 72.19,37.13 73.1,37.13 75.5,37.13 SJ3.2
GND  (via drill 0.5, 0.6)
  Top 0.254: U$1.11 32.94,35.3 C8.2 | 30.9,34.1 31.19,34.39 | U$1.51 49.52,35.8 | 49.52,35.8 49.53,35.81 | 49.52,35.8 49.52,35.52 49.89,35.15 | U1.18 63.82,36.26 v63.7,36.37 | SJ3.1 75.7,39.38 75.74,39.42 75.74,39.4 75.69,39.4 | SJ2.1 65.47,27.88 65.35,27.76 65.71,27.76 65.79,27.84 | v19.74,37.97 19.84,37.87 19.84,36.68 20.19,36.32 22.02,36.32 22.58,36.88 U3.8 | U$1.26 39.16,30.55 v40.92,32.31 41.67,31.56 U$1.31
  Top 0.406: U3.25 U3.24 13.19,40.15 v13.56,39.78 | v13.51,20.52 12.69,21.35 U4.24 U4.25 | U4.18 26.38,24.6 26.42,24.64 | U4.8 22.26,18.09 v22.25,18.09 | v7.77,28.4 4.47,28.4 | U3.18 24.14,45.28 26.39,47.52
  Bottom 0.254: v63.7,36.37 63.78,36.37 63.86,36.45 | v19.74,37.97 19.33,37.97 19.2,38.1 | v40.92,32.31 41,32.31 41.07,32.38
  Bottom 0.406: v13.56,39.78 13.56,39.42 | v13.51,20.52 13.82,20.52 13.92,20.62 | v22.25,18.09 22,18.09 | 19.15,38.05 19.2,38.1
  other vias: 4.42,28.4 32.79,38.1 25.98,27.13 84.23,43.33
  pour Bottom (isolate 0.406): 0.5,49.5 89.09,49.5 89.09,0.5 0.5,0.5
  pour Top (isolate 0.406, rank 3): 0.5,49.5 89.09,49.5 89.09,0.5 0.5,0.5
LED1
  Top 0.254: U$1.57 53.41,38.8 54.97,40.36 54.97,41.5 56.13,42.67 62.69,42.67 63.42,43.41 63.42,46.25 64.16,46.99 65.31,46.99 R4.1
LED2
  Top 0.254: U$1.56 54.09,38.29 55.78,39.98 55.78,41.22 56.57,42.01 63.22,42.01 64.16,42.95 64.16,44.07 64.62,44.53 65.29,44.53 R7.1
LED3  (via drill 0.5)
  Top 0.254: U$1.33 42.66,32.88 43.33,33.55 46.28,33.55 46.69,33.15 46.69,30.68 49.07,28.3 57.66,28.3 v58.06,27.89 | v63.83,40.84 64.16,40.84 R8.1
  Bottom 0.254: v58.06,27.89 58.06,31.85 62.31,36.09 62.31,37.47 63.55,38.71 63.55,40.56 v63.83,40.84
LED4  (via drill 0.5)
  Top 0.254: U$1.34 43.17,32.25 43.97,33.05 45.36,33.05 45.82,32.59 45.82,30.81 49.35,27.28 v56.24,27.28 | v61.92,39.52 65.37,39.52 R9.1
  Bottom 0.254: v61.92,39.52 61.34,38.94 61.34,36.96 56.41,32.03 56.41,27.46 v56.24,27.28
MCLR  (via drill 0.5)
  Top 0.254: JP3.1 45.92,3.76 44.7,4.98 R5.1 43.64,4.24 v43.64,2.64 | v37.39,13.11 37.34,13.16 37.34,17.02 35.36,19 35.36,29.87 36.07,30.58 36.07,32.26 37.34,33.53 38.48,33.53 38.99,34.04 38.99,36.04 38.72,36.31 U$1.9
  Bottom 0.254: v37.39,13.11 37.39,12.09 43.18,6.3 43.18,3.1 v43.64,2.64
N$1
  Top 0.254: R4.2 LED1.A
N$2
  Top 0.254: C7.1 R5.2 41.65,4.98 42.01,4.62 R6.2
N$3  (via drill 0.5)
  Top 0.254: v63.32,34.34 63.32,34.57 63.7,34.95 U1.20 | v71.5,35.48 74.07,35.48 C2.1
  Bottom 0.254: v63.32,34.34 63.88,34.9 70.92,34.9 v71.5,35.48
N$4
  Top 0.254: R7.2 69.04,44.56 LED2.A
N$5  (via drill 0.5)
  Top 0.254: U1.10 71.06,34.45 v71.42,34.09 | v71.22,31.29 71.22,29.58 C1.1
  Bottom 0.254: v71.42,34.09 71.42,31.5 v71.22,31.29
N$6
  Top 0.254: U2.ADJ 81.25,21.36 R3.2
N$7
  Top 2.54: J1.2 88.3,14.76 D1.A
N$8
  Top 0.254: R8.2 69.05,42.05 LED3.A
N$9
  Top 0.254: R9.2 69.08,39.5 LED4.A
N$14  (via drill 0.5)
  Top 0.406: U3.32 15.81,34.94 16.23,35.36 v16.23,37.52
  Bottom 0.406: 16.87,34.95 R11.1 | 17.17,35.2 R11.1 | v16.23,37.52 16.23,35.59 R11.1
N$15  (via drill 0.5)
  Top 0.406: U3.31 14.09,35.57 14.38,35.87 v14.38,37.34
  Bottom 0.406: v14.38,37.34 14.38,35.97 R12.1
N$16  (via drill 0.5)
  Top 0.406: U3.23 16.16,40.78 16.86,40.08 v16.86,39.58 v16.87,39.57
  Bottom 0.406: v16.87,39.57 16.87,41.8 R10.1
N$17
  Top 0.254: 24.1,37.49 U3.9 22.9,37.53 22.61,37.82 22.61,39.19 22.89,39.47 24.13,39.47 U3.12 | R17.2 30.06,39.27 | 30.06,39.27 C13.1 30.21,39.42 31.47,39.42 31.7,39.65 31.7,43.2 31.06,43.84 29.08,43.84 28.35,43.1 28.35,42.57 25.92,40.15 U3.13 | 30.06,39.27 28.28,39.27 R19.1
  Top 0.406: U3.13 U3.12
N$18
  Top 0.254: U4.9 29.47,18.73 R18.1 C12.1 | R16.2 C12.1 | U4.12 27.09,20.69 30.3,23.9 33.2,23.9 33.88,23.22 33.88,20.84 C12.1
  Top 0.406: U4.13 U4.12
N$19
  Top 0.254: R18.2 24.18,17.47 U4.7
N$20
  Top 0.254: U4.11 27.95,20.02 30,22.07 C12.2
  Top 0.406: U4.11 U4.10
N$21
  Top 0.254: U3.11 25.74,38.83 27.81,40.89 28.88,40.89 C13.2
  Top 0.406: U3.11 U3.10
N$22  (via drill 0.5)
  Top 0.406: U4.32 17.16,16.14 17.22,16.2 v17.22,17.98
  Bottom 0.406: v17.22,17.98 17.22,15.65 R15.1
N$23  (via drill 0.5)
  Top 0.406: U4.31 13.47,16.77 13.51,16.82 v13.51,17.88
  Bottom 0.406: v13.51,17.88 13.51,15.71 R14.1
N$24  (via drill 0.5)
  Top 0.406: U4.23 15.38,21.98 v16.97,23.57
  Bottom 0.406: v16.97,23.57 16.97,20.96 R13.1
N$25
  Top 0.406: U4.35 9.61,14.18 9.55,14.12 9.53,13.87 9.3,13.61 9.3,13.22 C17.2
N$26
  Top 0.406: U4.28 9.62,18.73 9.3,19.05 9.3,19.11 C18.2
N$27
  Top 0.406: U4.20 9.59,23.94 9.3,24.23 9.3,24.84 8.99,25.15 8.62,25.15 C19.2
N$28
  Top 0.406: C14.2 8.16,31.53 9.6,32.97 11.02,32.97 U3.35
N$29
  Top 0.406: U3.28 9.71,37.53 9.45,37.8 9.45,38.12 C15.2
N$30
  Top 0.406: U3.20 9.74,42.74 9.5,42.93 9.5,44.2 8.74,45.01 8.2,45.01 C16.2
N$31
  Top 0.254: JP2.3 41.27,45.01 40.66,44.4 40.66,42.16 U$1.72
N$32
  Top 0.254: U$1.73 40.17,46.19 38.86,47.5 38.86,47.8 JP2.4
N$33
  Top 0.254: JP2.5 36.19,47.12 37.59,45.72 39.12,45.72 39.65,45.19 39.65,42.17 U$1.74
N$34
  Top 0.254: U3.7 24.16,36.22 25.83,36.22 26.04,36.42 26.04,37.21 26.44,37.62 R19.2
N$35
  Top 0.254: JP2.6 33.65,47.63 36.32,44.96 38.61,44.96 39.12,44.45 39.12,44.42 39.14,44.4 39.14,44.37 39.17,44.35 39.17,42.16 U$1.75
N$36  (via drill 0.5)
  Top 0.254: U$1.54 49.06,37.3 50.04,36.32 57.84,36.32 59.31,37.8 v59.31,39.62
  Bottom 0.254: JP2.1 58.49,47.93 60.2,46.23 60.2,40.51 v59.31,39.62
N$37  (via drill 0.5)
  Top 0.254: U$1.55 49.31,37.81 50.29,36.83 57.15,36.83 57.66,37.34 v57.66,39.62
  Bottom 0.254: JP2.2 43.81,47.38 44.7,46.48 51,46.48 51.71,47.19 54.05,47.19 54.51,46.74 56.39,46.74 57.66,45.47 v57.66,39.62
N$38
  Top 0.254: 41.15,42.17 U$1.71 41.16,43.7 43.69,46.23 48.95,46.23 50.72,48.01 54.46,48.01 55.73,46.74 55.73,45.54 56.31,44.96 58.93,44.96 C26.1
N$39
  Top 0.254: U$1.70 41.67,43.2 44.2,45.72 50.09,45.72 51.49,47.12 53.77,47.12 54.28,46.61 54.28,44.37 54.97,43.69 61.21,43.69 61.72,44.2 61.72,45.06 C27.1
N$41
  Top 0.254: R20.1 66.23,3.98 C31.1
OTW1  (via drill 0.5)
  Top 0.254: U3.2 25.34,32.98 25.55,32.77 25.55,30.53 26.72,29.36 v28.09,29.36 | U$1.35 43.69,31.8 44.04,32.16 44.65,32.16 v44.68,32.18
  Bottom 0.254: v44.68,32.18 45.44,32.18 45.92,31.7 45.92,30.12 45.16,29.36 v28.09,29.36
OTW2  (via drill 0.5)
  Top 0.254: v32,10.67 28.83,10.67 25.31,14.18 U4.2 | v44.15,20.42 44.17,20.45 44.17,28.8 44.15,28.83 44.15,28.93 U$1.36
  Bottom 0.254: v44.15,20.42 41.71,17.98 40.77,17.98 33.71,10.92 32.26,10.92 v32,10.67
OUTA
  Top 0.406: U3.33 8.5,34.28 C14.1
  Top 0.813: JP4.3 7.73,34.37 C14.1
OUTB
  Top 0.406: U3.30 8.14,36.23 C15.1
  Top 0.813: C15.1 6.09,36.63 4.67,38.05 JP4.2
OUTC
  Top 0.406: U3.22 8.14,41.44 C16.1
  Top 0.813: JP4.1 8.14,41.73 C16.1
OUTD
  Top 0.406: U4.33 8.76,15.48 C17.1
  Top 0.813: JP5.3 5.41,15.47 6.04,14.83 8.11,14.83 C17.1
OUTE
  Top 0.406: U4.30 8.18,17.43 C18.1
  Top 0.813: JP5.2 4.37,19.15 6.1,17.42 8.13,17.42 C18.1
OUTF
  Top 0.406: U4.22 8.33,22.64 C19.1
  Top 0.813: JP5.1 8.14,22.83 C19.1
PGC  (via drill 0.5)
  Top 0.254: U$1.21 36.67,20.79 40.28,17.17 40.28,16.1 v40.23,16.05
  Bottom 0.254: v40.23,16.05 40.23,11.99 46.74,5.49 55.63,5.49 55.98,5.13 55.98,2.62 JP3.5
PGD  (via drill 0.5)
  Top 0.254: U$1.22 37.18,21.14 41.45,16.87 41.45,15.39 40.95,14.88 39.12,14.88 v38.86,14.63
  Bottom 0.254: v38.86,14.63 38.86,12.04 46.02,4.88 52.73,4.88 53.54,4.06 JP3.4
PVDD  (via drill 0.5)
  Top 0.254: R20.2 61.78,6.45 C30.1 | C5.1 68.76,12.17 68.94,12.34
  Top 0.305: C28.1 10.14,47.01 12.17,44.98 | C29.1 7.61,4.46 11.61,8.46 11.61,11.81 11.63,11.84
  Top 0.406: U3.19 12.87,43.4 12.9,43.43 | U3.21 12.79,42.08 12.8,42.06 | U3.29 12.79,36.9 | U4.21 12.89,23.28 12.9,23.27 | U4.19 12.69,24.6 12.7,24.59 | U4.29 12.33,18.09 12.34,18.09 | U4.36 12.59,13.52 12.6,13.51 | U4.34 12.84,14.84 12.85,14.83 | U4.17 22.46,23.94 22.4,23.88 | U3.1 22.47,32.32 22.35,32.21 | U3.17 22.32,42.74 22.3,42.72 | v21.03,44.5 21.34,44.5 | v20.98,35.15 21.18,35.15 | v20.93,37.24 20.78,37.24 | U3.34 12.48,33.64 12.5,33.63 | U3.36 12.79,32.32 12.85,32.26 | 22.1,13.46 22.16,13.52 U4.1 21.91,13.52 21.89,13.51 | v20.07,21.54 20.07,22.35 | v20.37,15.8 20.37,16.51 20.17,16.71 | v19.91,13.11 20.22,13.21 20.02,13.41
  Top 1.93: 17.14,12.62 17.02,12.75
  Top 2.184: 17.17,12.6 17.14,12.62
  Top 2.54: D1.C 80.68,14.99 78.03,12.34 | 78.03,12.34 68.94,12.34 65.51,12.34 62.03,8.87 62,8.87 61.65,8.51 59.72,8.51 C30.1 57.23,11 38.81,11 32.56,4.75 19.05,4.75 17.45,6.35 17.45,12.32 17.17,12.6 | 78.03,12.34 78.03,2.79 U2.V_IN
  Bottom 0.406: C23.1 v21.04,44.5 v21.03,44.5 | C21.1 20.69,34.86 v20.98,35.15 | C22.1 21.34,36.82 v20.93,37.24 | C20.1 20.28,21.33 v20.07,21.54 | C24.1 20.4,15.77 v20.37,15.8 | C25.1 20.47,12.7 v19.91,13.11
  pour Top (rank 2): 10.79,46.61 24.46,46.61 24.49,10.97 10.82,10.97
PWM1  (via drill 0.5)
  Top 0.254: U3.4 26.05,34.28 27.81,32.51 27.81,32.23 v28.07,31.98 27.84,32.21 | v38.15,38.41 38.15,42.14 U$1.77
  Bottom 0.254: v38.15,38.41 38.81,37.74 44.91,37.74 45.21,37.44 45.21,36.47 43.51,34.77 41.33,34.77 38.3,31.75 28.42,31.75 28.19,31.98 v28.07,31.98
PWM2  (via drill 0.5)
  Top 0.254: U3.6 27.14,35.57 v28.09,34.62 | v37.19,39.83 U$1.79
  Bottom 0.254: v37.19,39.83 31.39,34.04 30,34.04 29.36,34.67 28.14,34.67 v28.09,34.62
PWM3
  Top 0.254: U3.16 25.39,42.08 26.19,42.88 26.19,44.83 27.96,46.61 31.37,46.61 33.53,44.45 33.53,42.67 34.29,41.91 34.29,40.82 U$1.1 34.8,40.31
PWM4  (via drill 0.5)
  Top 0.254: U4.4 26.53,15.48 v28.45,13.56 | v32.87,41.76 32.87,40.13 33.68,39.32 U$1.3
  Bottom 0.254: v32.87,41.76 32.61,42.01 27.84,42.01 27.13,42.72 27.13,46.48 25.7,47.9 21.74,47.9 18.49,44.65 6.35,44.65 5.94,44.25 5.94,8.69 7.26,7.37 27.33,7.37 28.45,8.48 v28.45,13.56
PWM5  (via drill 0.5)
  Top 0.254: U$1.69 42.16,42.14 42.16,41.15 39.88,38.86 39.88,33.53 39.37,33.02 37.59,33.02 36.63,32.05 36.63,30.28 36.07,29.72 36.07,20.32 37.59,18.8 v37.59,18.03 | U4.6 28.64,16.77 29.44,15.98 29.44,15.16 v30.84,13.77 30.5,14.1
  Bottom 0.254: v37.59,18.03 37.85,17.78 37.85,17.53 34.09,13.77 v30.84,13.77
PWM6  (via drill 0.5)
  Top 0.254: U4.16 26.48,23.28 27.58,24.38 27.58,27.53 27.91,27.86 v28.12,27.86 | U$1.67 43.18,42.16 43.18,40.72 43.03,40.56 42.34,40.56 41.66,39.88 41.66,38.61 42.16,38.1 43.69,38.1 46.74,41.15 v49.94,41.15
  Bottom 0.254: v49.94,41.15 49.94,29.77 48.03,27.86 v28.12,27.86
RES1  (via drill 0.5, 0.6)
  Top 0.254: U3.5 26.3,34.94 27.84,33.4 28.7,33.4 v28.91,33.2 | U$1.58 46.02,39.32 42.57,35.87 v42.57,35.76
  Bottom 0.254: v28.91,33.2 29.13,33.2 29.46,32.87 37.87,32.87 40.77,35.76 v42.57,35.76
RES2  (via drill 0.5)
  Top 0.254: U3.14 25.69,40.78 27.69,42.77 27.69,43.36 29.18,44.86 31.29,44.86 v32.05,44.09 | v52.83,44.45 52.58,44.2 46.99,44.2 46.18,43.38 46.18,42.16 U$1.61
  Bottom 0.254: v32.05,44.09 52.48,44.09 v52.83,44.45
RES3  (via drill 0.5)
  Top 0.254: U3.15 25.62,41.44 27.05,42.88 27.05,44.4 v28.27,45.62 | v52.83,46.23 51.82,45.21 47.24,45.21 45.67,43.64 45.67,42.16 U$1.62
  Bottom 0.254: v52.83,46.23 51.82,45.21 31.55,45.21 31.14,45.62 v28.27,45.62
RES4  (via drill 0.5)
  Top 0.254: v53.03,42.16 47.95,42.16 v47.9,42.22 | v42.93,39.42 43.13,39.42 44.65,40.95 44.65,42.14 U$1.64 | U4.5 28.03,16.14 28.5,15.67 v28.5,15.01
  Bottom 0.254: v28.5,15.01 28.5,20.93 31.24,23.67 49.63,23.67 54.66,28.7 54.66,37.19 55.68,38.2 55.68,41.86 55.37,42.16 v53.03,42.16 | v47.9,42.22 45.72,42.22 v42.93,39.42
RES5  (via drill 0.5)
  Top 0.254: U4.14 27.32,21.98 v30.43,25.09 | 48.04,39.78 U$1.59 48.03,39.8 50.42,39.8 50.85,39.37 52.83,39.37 53.34,39.88 v53.34,40.89
  Bottom 0.254: v30.43,25.09 49.07,25.09 52.83,28.85 52.83,36.58 54.61,38.35 54.61,40.39 54.1,40.89 v53.34,40.89
RES6  (via drill 0.5)
  Top 0.254: U4.15 27.06,22.64 28.6,24.18 28.6,26.11 v29.21,26.72 | 48.04,40.28 U$1.60 48.03,40.31 51.49,40.31 51.51,40.28 v51.87,40.28
  Bottom 0.254: v29.21,26.72 48.97,26.72 51.51,29.26 51.51,39.93 v51.87,40.28
SCL
  Top 0.254: 61.29,33.43 60.73,33.43 59.18,31.88 52.93,31.88 51.01,33.8 U$1.47 | 61.29,33.43 64.62,33.43 U1.23 | R2.2 61.64,33.78 61.29,33.43
SDA
  Top 0.254: 64.08,32.89 61.29,32.89 59.54,31.14 52.6,31.14 50.45,33.29 U$1.46 | 64.08,32.89 U1.24 | R1.2 63.49,32.29 64.08,32.89
U1RX  (via drill 0.5)
  Top 0.254: v60.86,27.33 60.86,22.71 v61.27,22.3 | v60.86,30.2 51.33,30.2 50.23,31.31 U$1.42
  Bottom 0.254: v60.86,30.2 v60.86,27.33 | v61.27,22.3 63.48,22.3 68.07,26.9 77.8,26.9 80.77,29.87 80.77,36.22 81.81,37.26 87.74,37.26 JP1.2
U1TX  (via drill 0.5)
  Top 0.254: U$1.41 49.31,30.8 50.85,29.26 58.9,29.26 59.59,28.57 59.59,22.17 v61.27,20.5 | v82.6,35.36 82.6,38.81 83.57,39.78 JP1.3
  Bottom 0.254: v61.27,20.5 65.15,20.5 70.43,25.78 79.3,25.78 82.58,29.06 82.58,35.33 v82.6,35.36
U2RX  (via drill 0.5)
  Top 0.254: U$1.39 45.66,26.38 47.5,24.54 57.45,24.54 v57.84,24.16
  Bottom 0.254: v57.84,24.16 63.75,24.16 67.61,28.02 77.01,28.02 79.43,30.43 79.43,41.91 82.37,44.86 JP1.5
U2TX  (via drill 0.5)
  Top 0.254: U$1.40 46.17,27.42 47.68,25.91 57.76,25.91 v57.86,25.81
  Bottom 0.254: v57.86,25.81 63.65,25.81 67.08,29.23 76.71,29.23 78.28,30.81 78.28,44.22 81.46,47.4 JP1.6
VCC  (via drill 0.5)
  Top 0.254: C8.1 33.48,34.02 33.48,34.34 33.92,34.79 U$1.12 38.09,34.79 v38.1,34.8 | C9.2 U$1.25 38.67,31.41 40.84,33.58 40.84,34.11 40.95,34.21 40.89,34.27 40.93,34.3 | C3.1 42.18,26.6 U$1.32 42.19,34.2 | 50.02,16.3 C11.2 49.78,16.05 | R6.1 42.01,1.63 | JP3.2 | 54.5,33.59 C10.2 54.2,34.3 U$1.48 42.29,34.3 42.19,34.2 | 61.57,36.27 R2.1 | 68.02,37.01 68.02,37.08 | R1.1 63.49,29.91 v62.13,28.55 | 68.07,37.06 68.02,37.01 | 74.78,32.51 SJ1.1 | 74.69,23.85 C6.1 | v40.89,36.83 40.89,34.34 40.93,34.3 | 42.19,34.2 41.04,34.2 40.93,34.3 | U1.13 68.02,37.01
  Top 0.406: 42.01,1.63 42.98,0.66 48.11,0.66 48.46,1.02 JP3.2 | JP3.2 48.47,7.63 v48.56,7.72 | 49.78,16.05 v47.04,16.05 47.04,17.7 v48.08,18.75 | 54.5,33.59 55.5,32.59 58.9,32.59 60.17,33.86 60.17,35.69 60.76,36.27 61.57,36.27 | 68.02,37.08 67.64,37.47 62.77,37.47 R2.1 | v70.23,37.06 68.07,37.06 | v73.38,32.51 74.78,32.51 | SJ1.1 74.84,24.01 C6.1 | U2.V_OUT 71.73,22.27 73.3,23.85 74.69,23.85
  Bottom 0.254: v38.1,34.8 38.1,36.32 38.86,37.08 40.64,37.08 v40.89,36.83 | v70.23,37.06 65.96,37.06 64.34,35.43 62.71,35.43 59.16,31.88 59.16,31.62 59.61,31.17 61.34,31.17 61.95,30.56 61.95,28.73 v62.13,28.55 | 71.6,18.75 U2.V_OUT
  Bottom 0.406: v48.56,7.72 48.56,14.53 v47.04,16.05 | v70.23,37.06 73.13,37.06 73.38,36.8 v73.38,32.51 | v48.08,18.75 71.6,18.75
VIO
  Top 0.254: U1.8 69.41,33.41 70,32.82 70,31.77 69.37,31.14 68.86,31.14 68.38,30.66 C4.1

### Text on the board
tPlace: X | Y | Z
tNames: U2TX | U2RX | GND | U1TX | U1RX | GND | OUT: / C / B / A | OUT: / F / E / D | MCLR | VCC | GND | PGD | PGC | SALT Camera Gantry Controller v1.1